# EAGLE design A3941_MD_T (EAGLE 5.11)
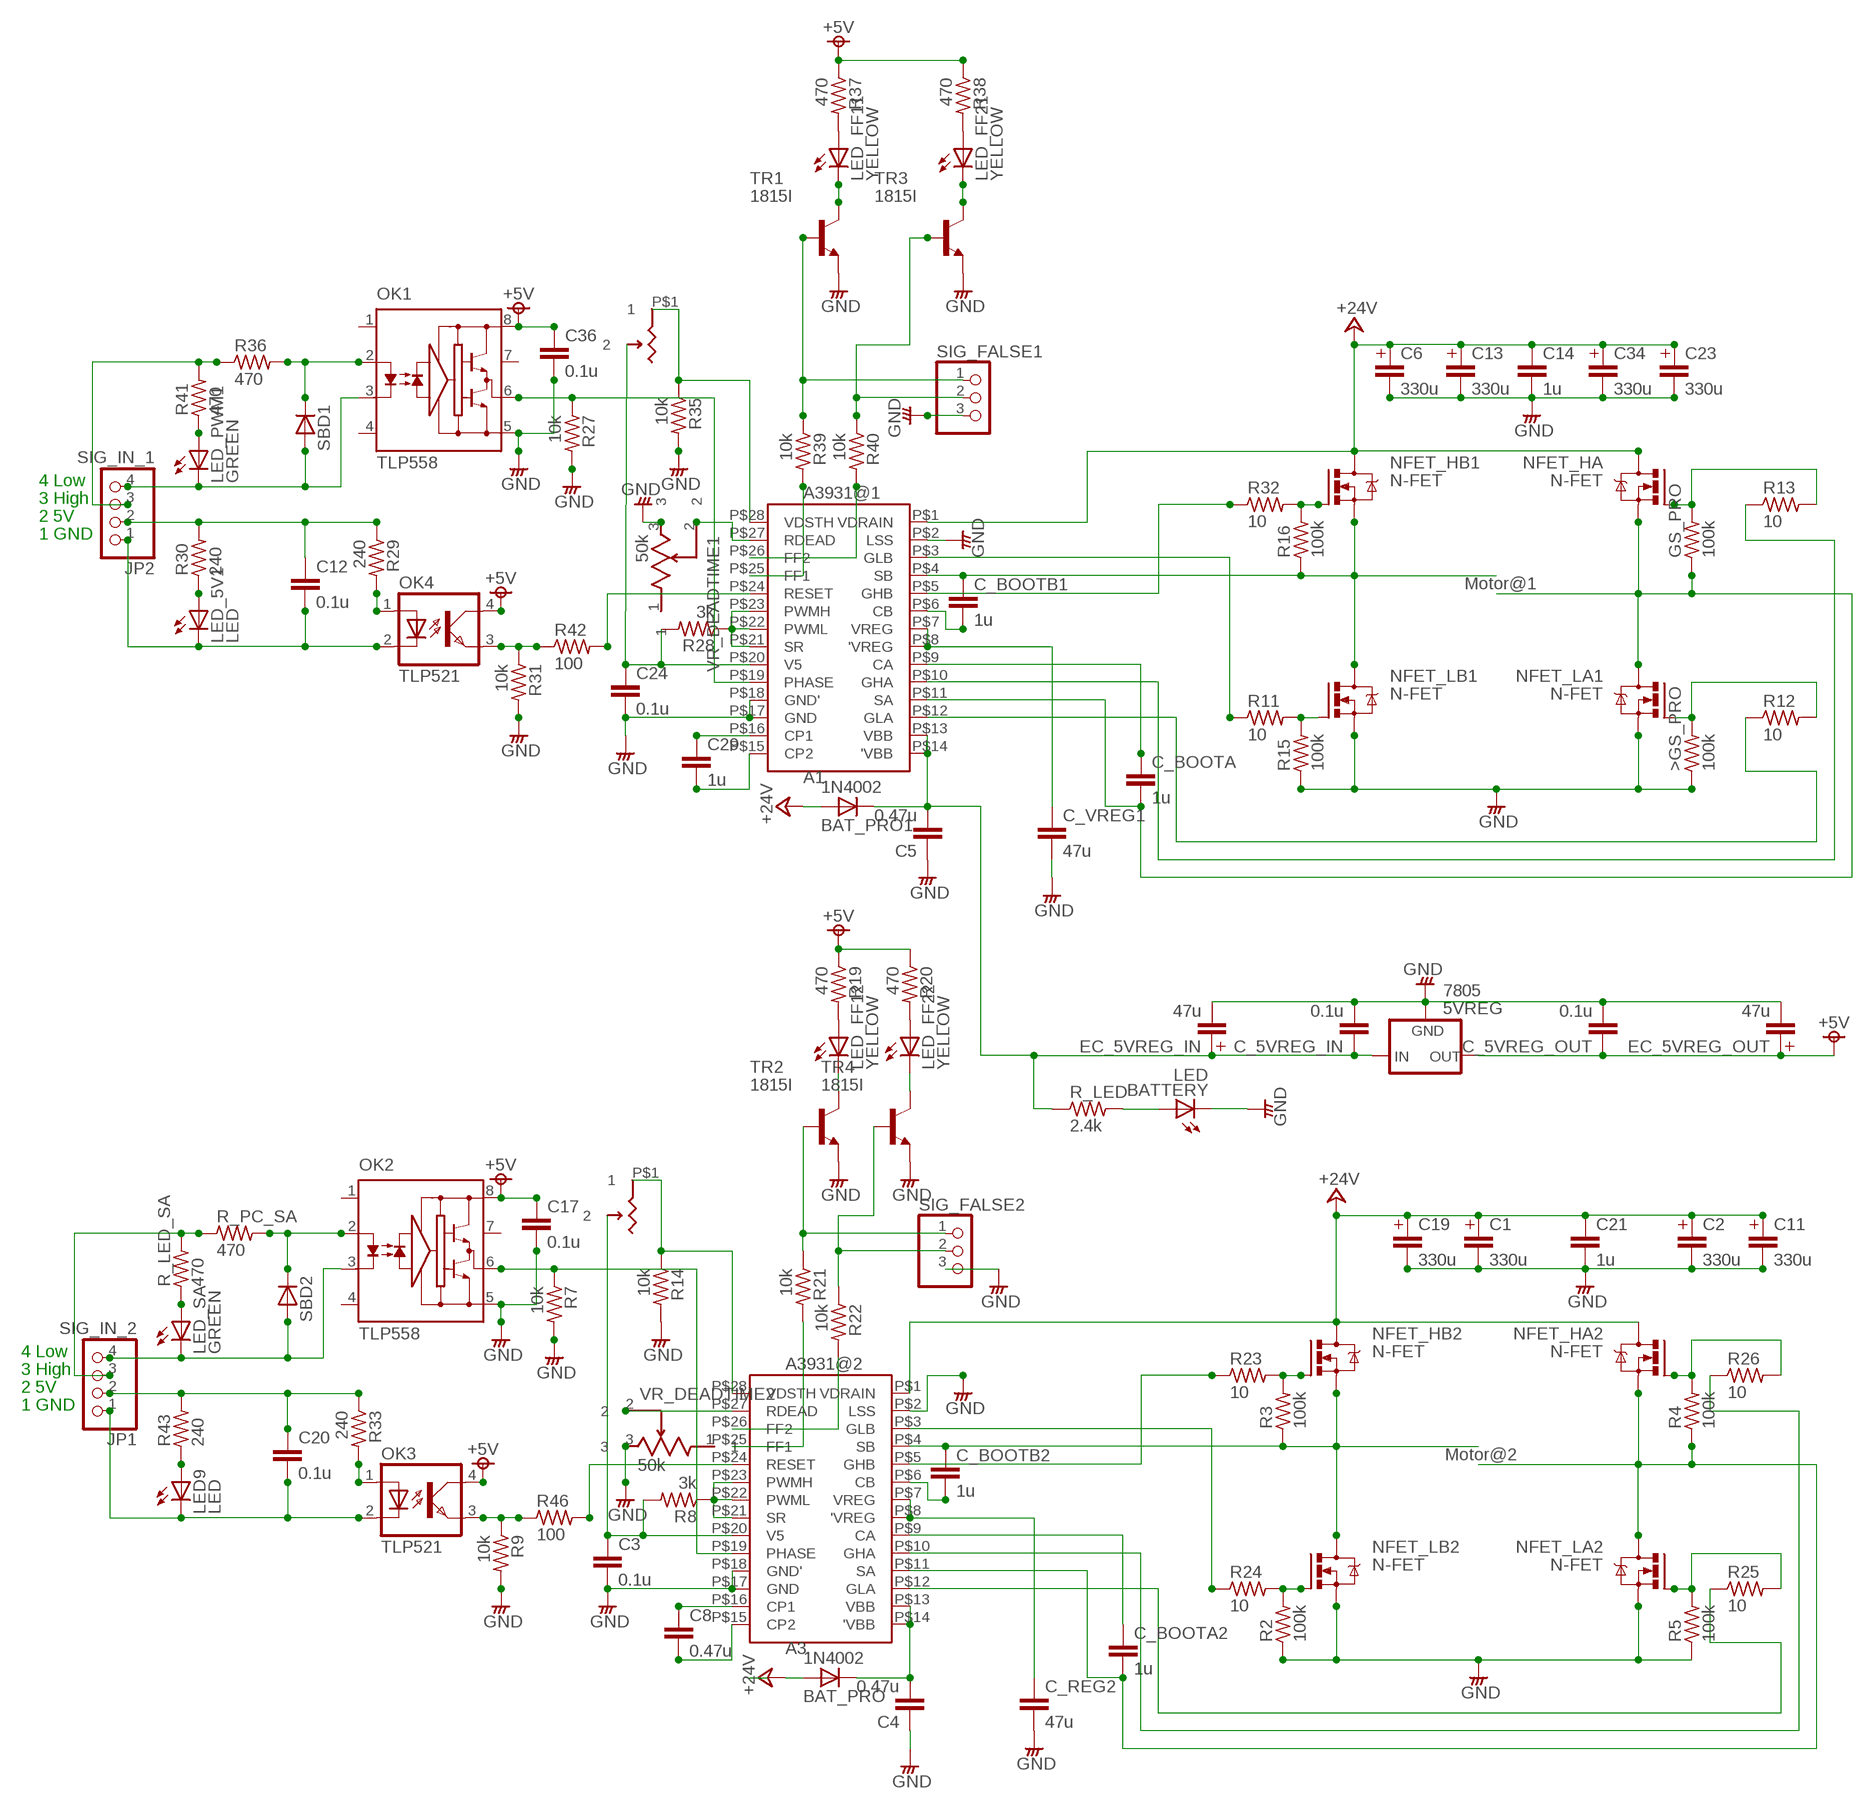
[diagram p0: schematic, sheet 1]

## Parts
5VREG  7805  78  [78XX]
>GS_PRO  100k  RESISTORS-3  [R_0.3]
A1  A3931@1  A3941  [IC_SOCKET_28_600MIL]
A3  A3931@2  A3941  [IC_SOCKET_28_600MIL]
BAT_PRO  1N4002  DIODE-2  [DIODE_2]
BAT_PRO1  1N4002  DIODE-2  [DIODE_2]
BATTERY  LED  LED3MM  [LED3MM]
C1  330u  CAPACITOR-3  [C_0.3]
C2  330u  CAPACITOR-3  [C_0.3]
C3  0.1u  MLCC-2  [MLCC_50]
C4  0.47u  MLCC-1  [MLCC_25]
C5  0.47u  MLCC-1  [MLCC_25]
C6  330u  CAPACITOR-3  [C_0.3]
C8  0.47u  MLCC-1  [MLCC_25]
C11  330u  CAPACITOR-3  [C_0.3]
C12  0.1u  MLCC-1  [MLCC_25]
C13  330u  CAPACITOR-3  [C_0.3]
C14  1u  MLCC-2  [MLCC_50]
C17  0.1u  MLCC-2  [MLCC_50]
C19  330u  CAPACITOR-3  [C_0.3]
C20  0.1u  MLCC-1  [MLCC_25]
C21  1u  MLCC-2  [MLCC_50]
C23  330u  CAPACITOR-3  [C_0.3]
C24  0.1u  MLCC-2  [MLCC_50]
C29  1u  MLCC-1  [MLCC_25]
C34  330u  CAPACITOR-3  [C_0.3]
C36  0.1u  MLCC-2  [MLCC_50]
C_5VREG_IN  0.1u  MLCC-1  [MLCC_25]
C_5VREG_OUT  0.1u  MLCC-1  [MLCC_25]
C_BOOTA  1u  MLCC-2  [MLCC_50]
C_BOOTA2  1u  MLCC-2  [MLCC_50]
C_BOOTB1  1u  MLCC-2  [MLCC_50]
C_BOOTB2  1u  MLCC-2  [MLCC_50]
C_REG2  47u  MLCC-1  [MLCC_25]
C_VREG1  47u  MLCC-1  [MLCC_25]
EC_5VREG_IN  47u  CAPACITOR-2  [C_0.2]
EC_5VREG_OUT  47u  CAPACITOR-2  [C_0.2]
GS_PRO  100k  RESISTORS-3  [R_0.3]
JP1  SIG_IN_2  PINHD-1X41  [1*04]
JP2  SIG_IN_1  PINHD-1X41  [1*04]
LED9  LED  LED3MM  [LED3MM]
LED_5V1  LED  LED3MM  [LED3MM]
LED_FF11  YELLOW  LED3MM  [LED3MM]
LED_FF12  YELLOW  LED3MM  [LED3MM]
LED_FF21  YELLOW  LED3MM  [LED3MM]
LED_FF22  YELLOW  LED3MM  [LED3MM]
LED_PWM1  GREEN  LED3MM  [LED3MM]
LED_SA  GREEN  LED3MM  [LED3MM]
NFET_HA  N-FET  [TO-220V]
NFET_HA2  N-FET  [TO-220V]
NFET_HB1  N-FET  [TO-220V]
NFET_HB2  N-FET  [TO-220V]
NFET_LA1  N-FET  [TO-220V]
NFET_LA2  N-FET  [TO-220V]
NFET_LB1  N-FET  [TO-220V]
NFET_LB2  N-FET  [TO-220V]
OK1  TLP558  TLP251  [DIP8]
OK2  TLP558  TLP251  [DIP8]
OK3  TLP521  TLP621  [DIP4]
OK4  TLP521  TLP621  [DIP4]
R2  100k  RESISTORS-3  [R_0.3]
R3  100k  RESISTORS-3  [R_0.3]
R4  100k  RESISTORS-3  [R_0.3]
R5  100k  RESISTORS-3  [R_0.3]
R7  10k  RESISTORS-2  [R_0.2]
R8  3k  RESISTORS-1  [R_0.1]
R9  10k  RESISTORS-2  [R_0.2]
R11  10  RESISTORS  [R_0.4]
R12  10  RESISTORS  [R_0.4]
R13  10  RESISTORS  [R_0.4]
R14  10k  RESISTORS-2  [R_0.2]
R15  100k  RESISTORS-3  [R_0.3]
R16  100k  RESISTORS-3  [R_0.3]
R19  470  RESISTORS-2  [R_0.2]
R20  470  RESISTORS-2  [R_0.2]
R21  10k  RESISTORS-2  [R_0.2]
R22  10k  RESISTORS-2  [R_0.2]
R23  10  RESISTORS  [R_0.4]
R24  10  RESISTORS  [R_0.4]
R25  10  RESISTORS  [R_0.4]
R26  10  RESISTORS  [R_0.4]
R27  10k  RESISTORS-2  [R_0.2]
R28  3k  RESISTORS-1  [R_0.1]
R29  240  RESISTORS-2  [R_0.2]
R30  240  RESISTORS-2  [R_0.2]
R31  10k  RESISTORS-2  [R_0.2]
R32  10  RESISTORS  [R_0.4]
R33  240  RESISTORS-2  [R_0.2]
R35  10k  RESISTORS-2  [R_0.2]
R36  470  RESISTORS-2  [R_0.2]
R37  470  RESISTORS-2  [R_0.2]
R38  470  RESISTORS-2  [R_0.2]
R39  10k  RESISTORS-2  [R_0.2]
R40  10k  RESISTORS-2  [R_0.2]
R41  470  RESISTORS-2  [R_0.2]
R42  100  RESISTORS-2  [R_0.2]
R43  240  RESISTORS-2  [R_0.2]
R46  100  RESISTORS-2  [R_0.2]
R_LED  2.4k  RESISTORS-2  [R_0.2]
R_LED_SA  470  RESISTORS-2  [R_0.2]
R_PC_SA  470  RESISTORS-2  [R_0.2]
SBD1  DIODE-2  [DIODE_2]
SBD2  DIODE-2  [DIODE_2]
SIG_FALSE1  PINHD-1X3-1  [1*03]
SIG_FALSE2  PINHD-1X3-1  [1*03]
TR1  1815I  [TO92A]
TR2  1815I  [TO92A]
TR3  1815I  [TO92A]
TR4  1815I  [TO92A]
VR1  50k  R_TRIM_2  [3362P_BOURNS_2PIN]
VR2  50k  R_TRIM_2  [3362P_BOURNS_2PIN]
VR_DEADTIME1  50k  SEMI_FIXED_RESISTOR_MULTI_TURN  [SEMI_FIXED_RESISTOR_MULTI_TURN]
VR_DEADTIME2  50k  SEMI_FIXED_RESISTOR_MULTI_TURN  [SEMI_FIXED_RESISTOR_MULTI_TURN]

## Nets
+5V: 5VREG.P$3(OUT) C17.1 C36.1 C_5VREG_OUT.1 EC_5VREG_OUT.P$1 OK1.8 OK2.8 OK3.4(COL) OK4.4(COL) R19.1 R20.1 R37.1 R38.1
+24V: A1.P$1(VDRAIN) A3.P$1(VDRAIN) BAT_PRO1.A BAT_PRO.A C1.P$1 C2.P$1 C6.P$1 C11.P$1 C13.P$1 C14.1 C19.P$1 C21.1 C23.P$1 C34.P$1 NFET_HA2.2(D) NFET_HA.2(D) NFET_HB1.2(D) NFET_HB2.2(D)
FF1: R21.1 SIG_FALSE2.1 TR2.B
FF2: R39.1 SIG_FALSE1.1 TR1.B
GND: 5VREG.P$2(GND) >GS_PRO.1 A1.P$2(LSS) A1.P$17(GND) A1.P$18(GND') A3.P$2(LSS) A3.P$17(GND) A3.P$18(GND') BATTERY.K(C) C1.P$2 C2.P$2 C3.2 C4.1 C5.1 C6.P$2 C11.P$2 C13.P$2 C14.2 C17.2 C19.P$2 C21.2 C23.P$2 C24.2 C34.P$2 C36.2 C_5VREG_IN.2 C_5VREG_OUT.2 C_REG2.2 C_VREG1.2 EC_5VREG_IN.P$2 EC_5VREG_OUT.P$2 NFET_LA1.3(S) NFET_LA2.3(S) NFET_LB1.3(S) NFET_LB2.3(S) OK1.5 OK2.5 R2.1 R5.1 R7.2 R9.2 R14.2 R15.1 R27.2 R31.2 R35.2 SIG_FALSE1.3 SIG_FALSE2.3 TR1.E TR2.E TR3.E TR4.E VR_DEADTIME1.3 VR_DEADTIME2.3
N$2: NFET_LB2.1(G) R2.2 R24.2
N$3: NFET_LA2.1(G) R5.2 R25.2
N$4: A3.P$11(SA) C_BOOTA2.2 NFET_HA2.3(S) NFET_LA2.2(D) R4.1
N$5: A1.P$4(SB) C_BOOTB1.1 NFET_HB1.3(S) NFET_LB1.2(D) R16.1
N$6: A3.P$10(GHA) R26.1
N$7: A3.P$3(GLB) R24.1
N$8: A3.P$12(GLA) R25.1
N$9: A3.P$19(PHASE) OK2.6 R7.1
N$10: A3.P$5(GHB) R23.1
N$11: A3.P$6(CB) C_BOOTB2.2
N$12: A3.P$9(CA) C_BOOTA2.1
N$13: A3.P$7(VREG) A3.P$8('VREG) C_REG2.1
N$14: A3.P$20(V5) C3.1 R8.2 VR2.P$2
N$15: BATTERY.A R_LED.2
N$16: OK3.3(EMIT) R9.1 R46.1
N$17: LED_5V1.A R30.1
N$18: A3.P$21(SR) A3.P$22(PWML) A3.P$23(PWMH) R8.1
N$19: NFET_LB1.1(G) R11.2 R15.2
N$20: NFET_HB1.1(G) R16.2 R32.2
N$21: >GS_PRO.2 NFET_LA1.1(G) R12.2
N$22: GS_PRO.2 NFET_HA.1(G) R13.2
N$23: A1.P$11(SA) C_BOOTA.2 GS_PRO.1 NFET_HA.3(S) NFET_LA1.2(D)
N$24: A3.P$4(SB) C_BOOTB2.1 NFET_HB2.3(S) NFET_LB2.2(D) R3.1
N$25: A1.P$10(GHA) R13.1
N$26: A1.P$3(GLB) R11.1
N$27: A1.P$12(GLA) R12.1
N$28: C12.1 JP2.2 R29.1 R30.2
N$29: A3.P$28(VDSTH) R14.1 VR2.P$1
N$30: R22.1 SIG_FALSE2.2 TR4.B
N$31: LED_FF12.A R19.2
N$32: LED_FF12.K(C) TR2.C
N$33: LED_FF22.A R20.2
N$34: LED_FF22.K(C) TR4.C
N$35: OK4.1(A) R29.2
N$36: A3.P$25(FF1) R21.2
N$37: A3.P$26(FF2) R22.2
N$38: LED9.A R43.1
N$39: C12.2 JP2.1 LED_5V1.K(C) OK4.2(C)
N$40: A1.P$27(RDEAD) VR_DEADTIME1.2
N$41: A1.P$19(PHASE) OK1.6 R27.1
N$42: A1.P$16(CP1) C29.1
N$43: A1.P$5(GHB) R32.1
N$44: A1.P$6(CB) C_BOOTB1.2
N$45: A1.P$9(CA) C_BOOTA.1
N$46: A1.P$7(VREG) A1.P$8('VREG) C_VREG1.1
N$47: LED_PWM1.A R41.1
N$48: C20.1 JP1.2 R33.1 R43.2
N$49: OK3.1(A) R33.2
N$50: A1.P$15(CP2) C29.2
N$51: A1.P$20(V5) C24.1 R28.2 VR1.P$2
N$52: OK4.3(EMIT) R31.1 R42.1
N$53: A1.P$21(SR) A1.P$22(PWML) A1.P$23(PWMH) R28.1
N$54: JP2.4 LED_PWM1.K(C) OK1.3 SBD1.A
N$55: OK1.2 R36.2 SBD1.C
N$56: JP2.3 R36.1 R41.2
N$58: A1.P$24(RESET) R42.2
N$59: A1.P$28(VDSTH) R35.1 VR1.P$1
N$60: R40.1 SIG_FALSE1.2 TR3.B
N$61: LED_FF11.A R37.2
N$62: LED_FF11.K(C) TR1.C
N$63: LED_FF21.A R38.2
N$64: LED_FF21.K(C) TR3.C
N$65: A1.P$25(FF1) R39.2
N$66: A1.P$26(FF2) R40.2
N$67: C20.2 JP1.1 LED9.K(C) OK3.2(C)
N$68: LED_SA.A R_LED_SA.1
N$69: JP1.4 LED_SA.K(C) OK2.3 SBD2.A
N$70: OK2.2 R_PC_SA.2 SBD2.C
N$72: JP1.3 R_LED_SA.2 R_PC_SA.1
N$73: A3.P$24(RESET) R46.2
N$74: A3.P$27(RDEAD) VR_DEADTIME2.2
N$75: A3.P$16(CP1) C8.1
N$76: A3.P$15(CP2) C8.2
N$77: NFET_HB2.1(G) R3.2 R23.2
N$78: NFET_HA2.1(G) R4.2 R26.2
N$87: A3.P$13(VBB) A3.P$14('VBB) BAT_PRO.C C4.2
N$94: 5VREG.P$1(IN) A1.P$13(VBB) A1.P$14('VBB) BAT_PRO1.C C5.2 C_5VREG_IN.1 EC_5VREG_IN.P$1 R_LED.1
Unconnected: OK1.1 OK1.4 OK1.7 OK2.1 OK2.4 OK2.7 VR_DEADTIME1.1 VR_DEADTIME2.1

## Notes on the sheet
- 4 Low
- 3 High
- 2 5V
- 1 GND
- Motor@1
- 4 Low
- 3 High
- 2 5V
- 1 GND
- Motor@2

## Library data of the parts
5VREG = regulator_s:78*: VOLTAGE REGULATOR
>GS_PRO GS_PRO R2-R5 R7-R9 R11-R16 R19-R33 R35-R43 R46 R_LED R_LED_SA R_PC_SA = rcl__s:RESISTORS
A1 A3 = DIP_CONVERTOR:A3941: KEL IC socket 28P / Akiduki / P-01563
BAT_PRO BAT_PRO1 SBD1 SBD2 = diode_s:DIODE
BATTERY LED9 LED_5V1 LED_FF11 LED_FF12 LED_FF21 LED_FF22 LED_PWM1 LED_SA = LED_s:LED: LED OSRAM: - CHIPLED LG R971, LG N971, LY N971, LG Q971, LY Q971, LO R971, LY R971 LH N974, LH R974 LS Q976, LO Q976, LY Q976 LO Q996 - Hyper CHIPLED LW Q18S LB Q993, LB Q99A, LB R99A - SideLED LS A670, LO A670, LY A670, LG A670, LP A670 LB A673, LV A673, LT A673, LW A673 LH A674 LY A675 LS A676, LA A676, LO A676, LY A676, LW A676 LS A679, LY A679, LG A679 - Hyper Micro SIDELED® LS Y876, LA Y876, LO Y876, LY Y876 LT Y87S - SmartLED LW L88C, LW L88S LB L89C, LB L89S, LG L890 LS L89K, LO L89K, LY L89K LS L896, LA L896, LO L896, LY L896 - TOPLED LS T670, LO T670, LY T670, LG T670, LP T670 LSG T670, LSP T670, LSY T670, LOP T670, LYG T670 LG T671, LOG T671, LSG T671 LB T673, LV T673, LT T673, LW T673 LH T674 LS T676, LA T676, LO T676, LY T676, LB T676, LH T676, LSB T676, LW T676 LB T67C, LV T67C, LT T67C, LS T67K, LO T67K, LY T67K, LW E67C LS E67B, LA E67B, LO E67B, LY E67B, LB E67C, LV E67C, LT E67C LW T67C LS T679, LY T679, LG T679 LS T770, LO T770, LY T770, LG T770, LP T770 LB T773, LV T773, LT T773, LW T773 LH T774 LS E675, LA E675, LY E675, LS T675 LS T776, LA T776, LO T776, LY T776, LB T776 LHGB T686 LT T68C, LB T68C - Hyper Mini TOPLED® LB M676 - Mini TOPLED Santana® LG M470 LS M47K, LO M47K, LY M47K Source: http://www.osram.convergy.de - LUMILED® LXK2-PW12-R00, LXK2-PW12-S00, LXK2-PW14-U00, LXK2-PW14-V00 LXK2-PM12-R00, LXK2-PM12-S00, LXK2-PM14-U00 LXK2-PE12-Q00, LXK2-PE12-R00, LXK2-PE12-S00, LXK2-PE14-T00, LXK2-PE14-U00 LXK2-PB12-K00, LXK2-PB12-L00, LXK2-PB12-M00, LXK2-PB14-N00, LXK2-PB14-P00, LXK2-PB14-Q00 LXK2-PR12-L00, LXK2-PR12-M00, LXK2-PR14-Q00, LXK2-PR14-R00 LXK2-PD12-Q00, LXK2-PD12-R00, LXK2-PD12-S00 LXK2-PH12-R00, LXK2-PH12-S00 LXK2-PL12-P00, LXK2-PL12-Q00, LXK2-PL12-R00 Source: www.luxeon.com
C1 C2 C6 C11 C13 C19 C23 C34 EC_5VREG_IN EC_5VREG_OUT = rcl__s:CAPACITOR
C3-C5 C8 C12 C14 C17 C20 C21 C24 C29 C36 C_5VREG_IN C_5VREG_OUT C_BOOTA C_BOOTA2 C_BOOTB1 C_BOOTB2 C_REG2 C_VREG1 = rcl__s:MLCC: CAPACITOR, European symbol
JP1 JP2 = pinhead_s:PINHD-1X4: PIN HEADER
NFET_HA NFET_HA2 NFET_HB1 NFET_HB2 NFET_LA1 NFET_LA2 NFET_LB1 NFET_LB2 = FET_s:N-FET
OK1 OK2 = photocoupler_s:TLP251
OK3 OK4 = photocoupler_s:TLP621: SHARP OPTO COUPLER
SIG_FALSE1 SIG_FALSE2 = pinhead_s:PINHD-1X3: PIN HEADER
TR1-TR4 = transistor_s:1815: NPN Transistor
VR1 VR2 = rlc_tutrobo:R_TRIM_2
VR_DEADTIME1 VR_DEADTIME2 = Semi_fixed_resistor_multi_turn:SEMI_FIXED_RESISTOR_MULTI_TURN

## Board
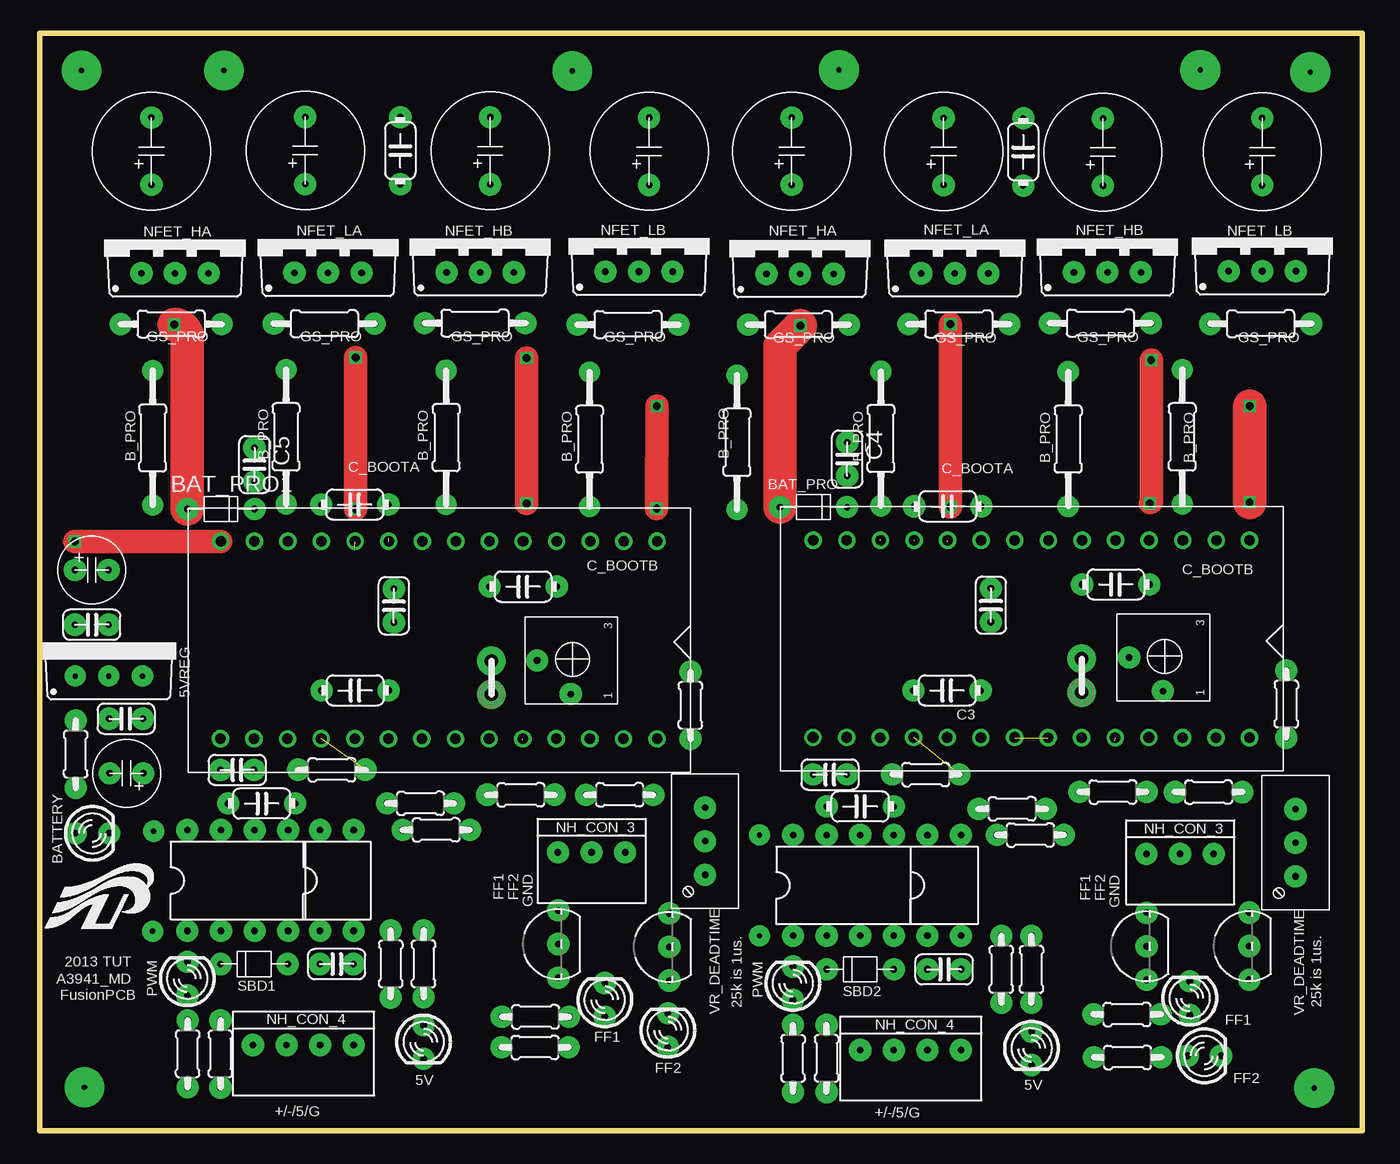
[diagram p1: board, top side]
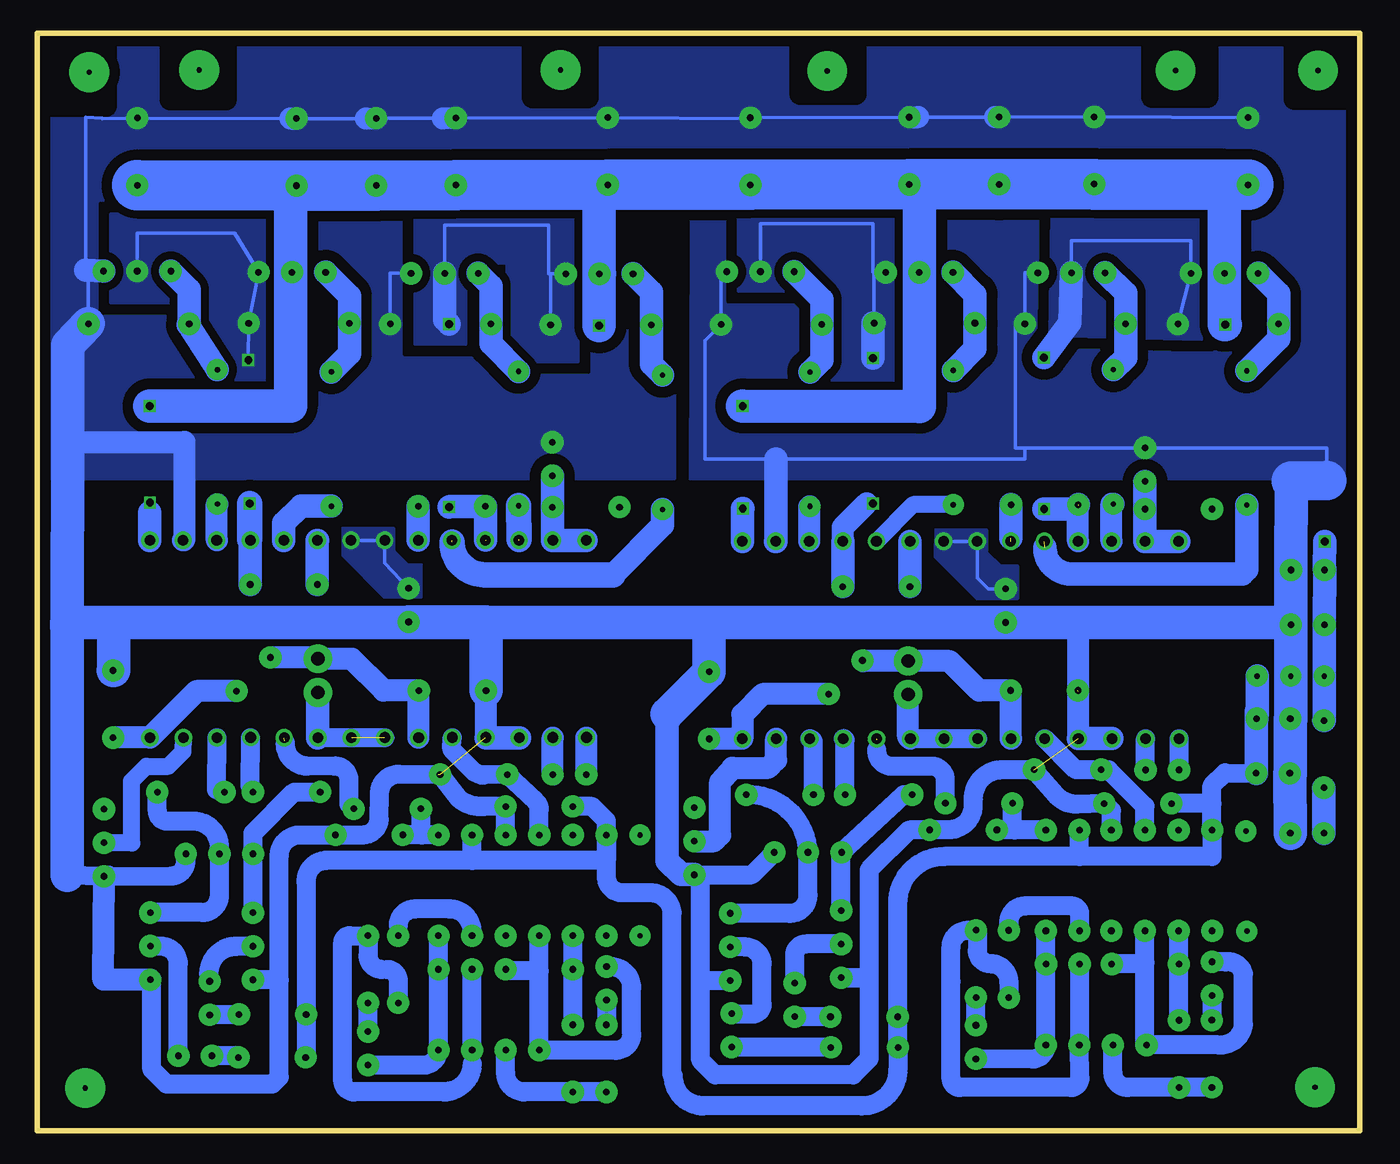
[diagram p2: board, bottom side, seen from below]

Size 100 x 83 mm. Coordinates in mm from the lower left corner, seen from the top.
Outline: 100,0 0,0 0,83 100,83 100,0
Copper layers (1*16): Top 0.035mm / dielectric 1.5mm / Bottom 0.035mm
Design rules "Fusion_eagle_rule_v1.1": minimum track width 6mil, minimum drill 12mil, track to track 6mil, track to pad 6mil, pad to pad 6mil, via to via 6mil, smd to smd 0mil, copper to edge 10mil, drill to drill 10mil, minimum pad ring 10mil, minimum via ring 6mil, stop-mask expansion 2mil, vias tented up to drill 100mil, thermal gap 10mil
bKeepout: area 92.6,-21.2 to 95.1,-18.7; 8 lines
tRestrict: area 38.1,78.4 to 42.3,82.5; area 45.7,87.3 to 50,91.4; area 58.4,78.1 to 62.6,82.3; area 85.7,78 to 89.9,82.2; area 94.9,77.5 to 99.1,81.7; area 11.8,78.2 to 16,82.3; area 0.9,78 to 5.2,82.2
bRestrict: area 38.1,87.3 to 42.3,91.4; area 38.1,78.4 to 42.3,82.5; area 58.3,78.1 to 62.6,82.3; area 85.7,78 to 89.9,82.2; area 94.8,77.5 to 99,81.7; area 11.5,78.2 to 15.7,82.3; area 0.7,78 to 5,82.2

### Footprints (pad centres in the part's own frame; a part is rotated, then mirrored left to right if it is on the bottom)
78XX = drill 0.399 pad 1.598 round: P$1 -2.54,0; P$2 0,0; P$3 2.54,0
R_0.3 = drill 0.5 pad 1.676 round: 1 -3.81,0; 2 3.81,0
IC_SOCKET_28_600MIL = drill 0.8 round: P$1 -16.51,-6.35; P$2 -13.995,-6.35; P$3 -11.455,-6.35; P$4 -8.915,-6.35; P$5 -6.375,-6.35; P$6 -3.835,-6.35; P$7 -1.295,-6.35; P$8 1.245,-6.35; P$9 3.785,-6.35; P$10 6.325,-6.35; P$11 8.865,-6.35; P$12 11.405,-6.35; P$13 13.945,-6.35; P$14 16.485,-6.35; P$15 16.51,8.56; P$16 13.97,8.56; P$17 11.43,8.585; P$18 8.89,8.56; P$19 6.35,8.56; P$20 3.81,8.585; P$21 1.27,8.56; P$22 -1.27,8.585; P$23 -3.81,8.585; P$24 -6.35,8.585; P$25 -8.89,8.56; P$26 -11.43,8.585; P$27 -13.97,8.585; P$28 -16.51,8.585
DIODE_2 = drill 0.5 pad 1.676 round: A -2.54,0; C 2.54,0
LED3MM = drill 0.5 pad 1.676 round: A -1.27,0; K 1.27,0
C_0.3 = drill 0.5 pad 1.676 round: P$1 -2.54,0; P$2 2.54,0
MLCC_50 = drill 0.5 pad 1.676 round: 1 -2.54,0; 2 2.54,0
MLCC_25 = drill 0.5 pad 1.676 round: 1 -1.27,0; 2 1.27,0
C_0.2 = drill 0.5 pad 1.676 round: P$1 -1.27,0; P$2 1.27,0
1*04 = drill 0.5 pad 1.676 round: 1 3.81,0; 2 1.27,0; 3 -1.27,0; 4 -3.81,0
TO-220V = drill 0.5 pad 1.676 round: 1 -2.54,0; 2 0,0; 3 2.54,0
DIP8 = drill 0.5 pad 1.676 round: 1 -3.81,-3.81; 2 -1.27,-3.81; 3 1.27,-3.81; 4 3.81,-3.81; 5 3.81,3.81; 6 1.27,3.81; 7 -1.27,3.81; 8 -3.81,3.81
DIP4 = drill 0.5 pad 1.676 round: 1 -1.27,-3.81; 2 1.27,-3.81; 3 1.27,3.81; 4 -1.27,3.81
R_0.2 = drill 0.5 pad 1.676 round: 1 -2.54,0; 2 2.54,0
R_0.1 = drill 1 pad 2.184 round: 1 -1.27,0; 2 1.27,0
R_0.4 = drill 0.399 pad 1.598 round: 1 -5.08,0; 2 5.08,0
1*03 = drill 0.5 pad 1.676 round: 1 -2.54,0; 2 0,0; 3 2.54,0
TO92A = drill 0.5 pad 1.676 round: B 2.54,0; C 0,0; E -2.54,0
3362P_BOURNS_2PIN = drill 0.5 pad 1.676 round: P$1 -2.54,-0.01; P$2 0,2.55
SEMI_FIXED_RESISTOR_MULTI_TURN = drill 0.5 pad 1.676 round: 1 -2.54,0; 2 0,0; 3 2.54,0

### Placement (x,y rotation side)
5VREG  5.23,34.37 0 top
>GS_PRO  21.52,61.02 180 top
A1  30.18,38.21 180 top
A3  74.99,38.29 180 top
BAT_PRO  58.52,47.15 0 top
BAT_PRO1  13.71,47.01 0 top
BATTERY  3.99,22.48 0 top
C1  56.87,74.07 90 top
C2  68.36,74.04 90 top
C3  68.61,33.28 180 top
C4  61.07,50.79 270 top
C5  16.25,50.36 270 top
C6  46.09,74.06 90 top
C8  59.77,26.93 180 top
C11  92.45,74.03 90 top
C12  22.46,12.59 0 top
C13  20.09,74.12 90 top
C14  27.27,74.1 90 top
C17  62.05,24.51 0 top
C19  80.4,74 90 top
C20  68.4,12.19 0 top
C21  74.38,74.01 90 top
C23  8.45,74.07 90 top
C24  23.86,33.28 180 top
C29  14.94,27.27 180 top
C34  34.07,74.1 90 top
C36  16.79,24.74 0 top
C_5VREG_IN  3.94,38.26 0 top
C_5VREG_OUT  6.53,31.15 180 top
C_BOOTA  23.83,47.34 180 top
C_BOOTA2  68.67,47.21 180 top
C_BOOTB1  36.56,41.14 180 top
C_BOOTB2  81.37,41.3 180 top
C_REG2  71.93,39.73 270 top
C_VREG1  26.78,39.69 270 top
EC_5VREG_IN  3.94,42.39 0 top
EC_5VREG_OUT  6.57,27.02 180 top
GS_PRO  9.95,61 180 top
JP1  65.86,6.1 0 top
JP2  19.94,6.47 0 top
LED9  75.01,6.22 270 top
LED_5V1  29.03,6.7 270 top
LED_FF11  42.74,9.89 90 top
LED_FF12  86.97,10.02 90 top
LED_FF21  47.51,7.59 90 top
LED_FF22  88.07,5.66 0 top
LED_PWM1  11.17,11.49 90 top
LED_SA  56.96,11.14 90 top
NFET_HA  10.23,64.83 0 top
NFET_HA2  57.5,64.79 0 top
NFET_HB1  33.31,64.9 0 top
NFET_HB2  80.74,64.92 0 top
NFET_LA1  21.81,64.87 0 top
NFET_LA2  69.2,64.83 0 top
NFET_LB1  45.32,64.96 0 top
NFET_LB2  92.45,64.99 0 top
OK1  14.98,18.91 0 top
OK2  60.78,18.54 0 top
OK3  68.4,18.54 0 top
OK4  22.47,18.91 0 top
R2  92.33,61.01 180 top
R3  80.22,61.06 180 top
R4  57.39,60.94 180 top
R5  69.51,60.99 180 top
R7  67.01,26.93 0 top
R8  78.79,34.41 90 top
R9  74.92,22.36 0 top
R11  41.59,52.29 90 top
R12  18.63,52.46 90 top
R13  8.55,52.38 90 top
R14  94.28,32.25 90 top
R15  44.49,60.96 180 top
R16  32.92,61.06 180 top
R19  82.22,8.78 0 top
R20  82.26,5.53 0 top
R21  81.16,25.61 0 top
R22  88.39,25.6 180 top
R23  77.78,52.3 90 top
R24  86.4,52.46 90 top
R25  63.62,52.34 90 top
R26  52.73,52.05 90 top
R27  22.1,27.29 0 top
R28  34.16,34.24 90 top
R29  26.55,12.61 90 top
R30  29.02,12.61 90 top
R31  29.98,22.74 0 top
R32  30.74,52.41 90 top
R33  72.72,12.19 90 top
R35  49.21,32.16 90 top
R36  13.67,5.8 90 top
R37  37.5,8.61 0 top
R38  37.46,6.29 0 top
R39  36.39,25.4 0 top
R40  43.86,25.4 180 top
R41  11.19,5.81 270 top
R42  28.8,24.75 0 top
R43  75.01,12.19 90 top
R46  73.54,24.34 0 top
R_LED  2.72,28.47 270 top
R_LED_SA  56.97,5.46 270 top
R_PC_SA  59.51,5.46 90 top
SBD1  16.22,12.59 180 top
SBD2  62.05,12.19 180 top
SIG_FALSE1  41.73,21.04 0 top
SIG_FALSE2  86.24,20.93 0 top
TR1  39.22,14.1 90 top
TR2  83.7,13.94 90 top
TR3  47.61,13.89 90 top
TR4  91.46,13.95 90 top
U$4  [TUTLOGO]  0.39,14.82 0 top
U$12  [WORLD_MAP_1000X600]  -22.86,12.7 0 top  (outside the outline)
VR1  40.16,35.55 90 top
VR2  84.93,35.78 90 top
VR_DEADTIME1  50.32,21.88 270 top
VR_DEADTIME2  94.96,21.76 270 top

### Tracks (layer width: path | path; a pad name or v marks a point on that pad's centre or on a via)
+5V
  Bottom 1.016: 34.96,6.29 R38.1 34.94,6.29 | OK1.8 11.18,22.72
  Bottom 1.422: 34.96,6.29 R37.1 34.96,17.2 arc90 31.43,20.73 21.2,20.73 | 21.2,20.73 OK4.4 | OK2.8 56.97,19.19 arc-90 55.77,17.99 53.87,17.99 arc90 52,16.5 52,4.15 51.92,4.15 arc-90 49.63,1.87 37.68,1.87 arc-90 34.94,4.57 34.94,6.29 | 11.18,22.72 11.18,20.73 21.2,20.73 | 67.13,20.43 OK3.4 | OK2.8 56.97,20.43 67.13,20.43 | 67.13,20.43 78.2,20.43 arc-90 79.69,18.79 R19.1 79.68,5.71 R20.1 79.69,5.56 | 11.18,24.73 11.18,26.09 10.21,27.07 EC_5VREG_OUT.P$1 | 11.18,24.73 11.18,22.98 OK1.8 | C36.1 11.19,24.74 11.18,24.73 | OK2.8 56.97,23.43 58.05,24.51 C17.1 | 7.81,31.71 C_5VREG_OUT.1
  Bottom 1.778: C_5VREG_OUT.1 7.77,31.6 5VREG.P$3 | EC_5VREG_OUT.P$1 7.81,31.71
+24V  (via drill 0.6)
  Top 1.778: v46.67,54.8 v46.66,47.03
  Top 2.54: v91.51,54.78 v91.49,47.5 | v10.16,60.96 arc-90 11.17,59.95 BAT_PRO1.A | BAT_PRO.A 55.98,59.31 v57.53,60.87
  Bottom 0.254: v91.49,47.5 91.51,46.76 91.5,46.74 | C34.P$1 33.31,71.57 | NFET_HA2.2 57.5,64.67 57.53,64.67 | C1.P$1 57.53,71.46 | 80.85,64.92 NFET_HB2.2
  Bottom 1.676: C11.P$1 92.32,71.46
  Bottom 1.778: 91.5,46.74 A3.P$1 | A1.P$1 46.7,47 arc90 v46.66,47.03
  Bottom 2.54: 33.31,71.57 NFET_HB1.2 33.31,54.76 v46.67,54.8 | v10.16,60.96 10.23,60.96 NFET_HA.2 10.23,71.53 10.16,71.53 | 57.53,71.46 57.53,64.67 | v57.53,60.87 57.53,64.77 NFET_HA2.2 | 81.66,71.47 80.85,70.66 80.85,64.92 80.85,54.8 91.49,54.8 v91.51,54.78
  Bottom 3.81: C11.P$1 81.66,71.47 C19.P$1 C21.1 C2.P$1 C1.P$1 C6.P$1 C34.P$1 C14.1 C13.P$1 20.07,71.53 10.16,71.53 C23.P$1
D2  (via drill 0.4 pad 3)
  other vias: 87.77,80.2
FF1
  Bottom 1.016: SIG_FALSE2.1
  Bottom 1.422: TR2.B SIG_FALSE2.1 | R21.1 80.57,25.61 83.7,22.48 SIG_FALSE2.1
FF2
  Bottom 1.016: 39.22,21.04 SIG_FALSE1.1
  Bottom 1.422: TR1.B 39.22,21.04 | R39.1 34.51,25.39 SIG_FALSE1.1
GND  (4 unrouted)
  Bottom 0.254: 27.6,76.65 C34.P$2 | 33.4,76.65 C6.P$2 46.09,76.53 C1.P$2 | C2.P$2 57.64,76.55 | C21.2 69.35,76.55 | C19.P$2 75.15,76.54 | 80.85,76.54 C11.P$2 95.09,76.54 95.09,76.55 96.36,76.64 96.36,65.09 | NFET_LB2.3 96.16,64.99 R2.1 | C23.P$2 C13.P$2 C14.2 | NFET_LA1.3 25.33,64.87 >GS_PRO.1 26.05,61.02 26.03,51.63 25.33,51.63 | 25.33,51.63 25.33,50.8 44.16,50.8 48.28,50.79 48.31,50.77 49.54,50.77 49.53,59.73 R15.1 48.3,64.95 NFET_LB1.3 | 25.33,51.63 C5.1 2.5,51.63 2.5,49.17 | NFET_LA2.3 73.32,64.83 R5.1
  Bottom 1.016: VR_DEADTIME2.3 94.57,19.53
  Bottom 1.422: 69.7,26.92 72.69,26.96 arc-90 74.13,25.44 74.15,23.53 arc84 75.39,22.36 R9.2 80.12,22.36 arc-91 81.72,20.8 81.72,11.39 | OK2.5 C17.2 66.25,24.51 arc45 68.12,25.1 R7.2 | 81.72,11.39 TR2.E | SIG_FALSE2.3 88.78,20.39 arc90 89.91,19.25 VR_DEADTIME2.3 94.96,19.24 97.74,19.31 | A1.P$17 18.75,29.65 | TR4.E 91.34,11.41 91.34,4.63 90.23,3.51 82.24,3.51 81.72,4.03 81.72,11.39 | 81.72,11.39 | 66.07,29.71 arc90 A3.P$18 | OK1.5 18.79,24.2 C36.2 21.4,24.67 arc47 22.96,25.35 R27.2 27.09,27.29 arc-90 29.25,25.04 29.24,24.53 arc90 31.09,22.76 R31.2 32.53,22.73 34.07,22.73 37.11,19.7 37.11,11.56 TR1.E 37.1,11.56 37.1,5.44 38.33,4.22 48.75,4.22 49.85,5.32 49.85,11.43 | 49.85,11.43 49.85,18.87 VR_DEADTIME1.3 | TR3.E 49.77,11.35 49.85,11.43 | VR_DEADTIME1.3 45.97,19.34 SIG_FALSE1.3 | VR_DEADTIME1.3 arc90 50.33,19.33
  Bottom 1.676: C14.2 27.6,76.65 | C34.P$2 33.4,76.65 | 69.35,76.55 C2.P$2 | 75.15,76.54 C21.2 | 80.85,76.54 C19.P$2 | A1.P$17 | TR4.E 95.01,11.41 VR_DEADTIME2.3 | A1.P$18 21.29,33.23 | C3.2 66.07,29.75 A3.P$18 | C24.2 21.32,38.15 21.59,38.42 | VR_DEADTIME1.3 50.35,19.37 | A3.P$2 arc-90 88.9,44.72 88.9,52.07 97.72,52.07
  Bottom 1.778: 18.75,29.65 A1.P$18 | A3.P$17 66.07,29.71 | NFET_LB2.3 96.36,65.09 | BATTERY.K | EC_5VREG_OUT.P$2 5.26,26.92 | C_5VREG_OUT.2 5.23,31.06 | 5VREG.P$2 5.21,34.37 | A1.P$2 arc-90 44.16,44.58 44.16,50.8 | 50.35,19.37 51.34,19.37 52.38,20.41 52.38,31.52
  Bottom 2.54: BATTERY.K EC_5VREG_OUT.P$2 | 5.26,26.92 C_5VREG_OUT.2 | 5.23,31.06 5VREG.P$2 | 97.74,19.31 97.73,38.55 97.72,52.07 97.72,59.39 R2.1 | 5.18,49.1 EC_5VREG_IN.P$2 arc-90 EC_5VREG_IN.P$2 C_5VREG_IN.2 | 5.21,34.37 C_5VREG_IN.2 | C_5VREG_IN.2 5.21,38.42 21.59,38.42 C_VREG1.2 94.25,38.42 | 45.49,38.42 arc-90 45.49,38.43 49.21,38.43 R35.2 52.38,31.52 | 94.25,38.42 97.79,38.42 97.79,38.1 | R14.2 94.25,34.79 94.25,38.42 | C3.2 66.07,38.47 C_REG2.2
  Bottom 3: 5.18,49.1 2.5,49.17
  pour Bottom (isolate 0.813, rank 4, no thermals): -5.08,86.36 50.48,86.36 50.61,49.29 -4.96,49.3
  pour Bottom (isolate 0.813, rank 4, no thermals): 106.68,86.36 106.8,49.31 51.83,49.31 51.79,74.37 49.51,74.37 49.53,86.36
N$1  (via drill 0.4 pad 1.6)
  other vias: 54.43,14.73
N$2
  Bottom 1.778: NFET_LB2.1 88.52,63.6 R2.2 88.59,60.95 R24.2
N$3
  Bottom 1.778: R25.2 65.7,59.5 R5.2 65.7,63.87 NFET_LA2.1
N$4  (via drill 0.6)  (1 unrouted)
  Top 1.778: v68.86,47.14 v68.87,60.99
  Bottom 0.254: R4.1 61.2,64.79 NFET_HA2.3 61.34,64.79 61.34,68.48 69.2,68.48 NFET_LA2.2
  Bottom 1.778: v68.87,60.99 69.2,61.32 NFET_LA2.2 | A3.P$11 C_BOOTA2.2 68.8,47.21 v68.86,47.14
  pour Bottom (isolate 0.61, no thermals): 59.14,69.36 71.45,69.36 71.45,59.49 67.63,59.49 67.63,65.6 64.48,65.6 64.48,58.17 59.14,58.17
N$5  (via drill 0.6)
  Top 1.778: v36.83,47.42 v36.83,58.42
  Bottom 0.254: R16.1 36.73,64.91 NFET_HB1.3 36.83,64.91 36.83,68.58 45.32,68.58 NFET_LB1.2 | 37.3,47.42 v36.83,47.42
  Bottom 1.676: 37.3,47.42 39.09,45.63 A1.P$4
  Bottom 1.778: v36.83,58.42 36.83,61.06 R16.1 | A1.P$4 C_BOOTB1.1
  pour Bottom (isolate 0.61, no thermals): 34.29,69.85 46.99,69.85 46.99,63.5 40.64,63.5 40.64,55.88 34.29,55.88
N$6  (1 unrouted)
  Bottom 1.778: R26.1 52.73,45.78 56.48,42.03
  Bottom 1.93: 56.48,42.03 66.19,42.03 arc90 68.66,44.5
N$7
  Bottom 1.676: R24.1 arc-90 86.44,47.34 A3.P$3
N$8  (1 unrouted)
  Bottom 1.93: 63.58,44.7 R25.1
N$9
  Bottom 1.422: OK2.6 62.05,24.29 arc-47 62.31,24.88 R7.1 66.24,26.88 arc42 67.02,27.18 68.67,28.83 A3.P$19
N$10
  Bottom 1.778: R23.1 80.08,47.22 81.36,45.93 A3.P$5 | A3.P$5
N$11
  Bottom 1.778: A3.P$6 C_BOOTB2.2
N$12
  Bottom 1.676: A3.P$9
  Bottom 1.778: A3.P$9 71.21,44.66 C_BOOTA2.1
N$13
  Bottom 0.254: C_REG2.1 73.74,42.92 A3.P$8 A3.P$7
  pour Bottom (no thermals): 73.05,45.32 73.05,43.82 72,42.77 70.98,42.79 70.98,40.35 73.75,40.33 76.9,43.48 76.9,45.55 73.06,45.55
N$14
  Bottom 1.676: VR2.P$2 78.89,35.78 R8.2 76.23,35.68 73.83,33.28 C3.1 71.18,33.26 A3.P$20
N$15
  Bottom 1.778: R_LED.2 BATTERY.A
N$16
  Bottom 1.016: 70.94,22.36 71,22.42
  Bottom 1.422: OK3.3 69.75,22.36 70.94,22.36 R9.1 | 71,22.42 R46.1
N$17
  Bottom 1.422: LED_5V1.A R30.1
N$18  (1 unrouted)
  Bottom 1.422: A3.P$23 73.74,29.71 arc-90 A3.P$21
  Bottom 1.778: R8.1 arc-90 R8.1 A3.P$23
N$19
  Bottom 1.778: NFET_LB1.1 40.68,62.85 R15.2 40.68,58.27 R11.2
N$20
  Bottom 1.778: NFET_HB1.1 29.11,63.24 R16.2 29.11,59.13 R32.2
N$21
  Bottom 1.778: NFET_LA1.1 17.71,63.32 >GS_PRO.2 17.71,58.46 R12.2
N$22
  Bottom 1.778: NFET_HA.1 6.14,63.28 GS_PRO.2 6.14,59.88 R13.2
N$23  (via drill 0.6)  (1 unrouted)
  Top 1.778: v23.88,47.02 v23.89,58.47
  Bottom 0.254: GS_PRO.1 NFET_HA.3 12.77,67.31 21.81,67.31 NFET_LA1.2
  Bottom 1.676: A1.P$11 21.31,47.27
  Bottom 1.778: C_BOOTA.2 21.29,47.29 21.59,46.99 23.85,46.99 v23.88,47.02 | v23.89,58.47 21.91,61.11 NFET_LA1.2
  pour Bottom (isolate 0.61, no thermals): 11.94,69.21 23.28,69.26 23.43,60.13 12,59.8
N$24  (via drill 0.6)
  Top 1.676: v83.94,47.43 84.05,47.53
  Top 1.778: 84.05,47.53 v84.05,58.27
  Bottom 0.254: NFET_LB2.2 92.45,67.86 85.09,67.86 NFET_HB2.3 R3.1 v84.05,58.27
  Bottom 1.676: A3.P$4 83.94,44.68
  Bottom 1.778: A3.P$4 C_BOOTB2.1
  Bottom 1.93: 83.94,44.68 v83.94,47.43
  pour Bottom (isolate 0.61, no thermals): 94.48,69.31 94.48,62.61 87.52,62.61 87.52,56.38 82.35,56.38 82.35,69.3 82.37,69.3
N$25  (1 unrouted)
  Bottom 1.778: 16.47,42.1 11.68,42.1 | 16.47,42.1 21.84,42.1 arc90 23.82,44.09 | R13.1 8.55,42.44 8.88,42.11 16.46,42.11 16.47,42.1
N$26
  Bottom 1.676: R11.1 41.63,47.16 A1.P$3
N$27
  Bottom 1.676: R12.1 18.77,47.38 A1.P$12
N$28
  Bottom 1.016: JP2.2 21.19,6.47 | 29.65,15.15 R30.2 28.93,15.15
  Bottom 1.422: 21.19,6.47 C12.1 | JP2.2 21.17,3.97 arc91 21.87,3.26 30.21,3.26 arc88 30.92,3.94 30.91,11.26 30.91,13.89 arc90 29.65,15.15 | 28.93,15.15 28.93,13.62 arc-90 27.94,12.63 arc90 26.55,11.24 R29.1
N$29
  Bottom 1.676: VR2.P$1 87.96,33.24 A3.P$28 R14.1
N$30
  Bottom 1.422: R22.1 90.93,24.15 arc-89 90.16,23.4 88.2,23.4 arc90 86.24,21.43 SIG_FALSE2.2 86.24,17.79 arc90 87.53,16.49 TR4.B
N$31
  Bottom 1.016: R19.2 84.93,8.75
  Bottom 1.422: 84.93,8.75 LED_FF12.A
N$32
  Bottom 1.422: TR2.C 84.98,13.93 arc-105 LED_FF12.K
N$33
  Bottom 1.422: R20.2 84.96,5.66 LED_FF22.A
N$34
  Bottom 1.422: LED_FF22.K 89.35,12.63 arc-90 90.67,13.94 TR4.C
N$35
  Bottom 1.016: OK4.1 21.17,15.1
  Bottom 1.422: R29.2 26.55,15.74 arc90 25.3,16.99 21.81,16.99 arc90 21.17,16.36 21.17,15.1
N$36
  Bottom 1.016: R21.2 83.89,25.96
  Bottom 1.422: 83.89,25.96 83.91,25.96 A3.P$25
N$37
  Bottom 1.422: R22.2 86.44,25.78 86.45,25.78 A3.P$26
N$38
  Bottom 1.422: LED9.A R43.1
N$39
  Bottom 1.016: 23.73,15.1 OK4.2 | 23.75,12.59 C12.2 | JP2.1 23.75,6.43
  Bottom 1.422: C12.2 23.73,15.1 | JP2.1 23.75,12.59 | 23.75,6.43 arc91 24.77,5.41 LED_5V1.K
N$40
  Bottom 1.676: A1.P$27 44.15,28.02 44.74,27.43 47.45,27.43 48.37,26.38 48.37,22.36 48.84,21.88 VR_DEADTIME1.2
N$41
  Bottom 1.422: A1.P$19 21.47,27.29 R27.1 19,27.29 16.25,24.53 OK1.6
N$42
  Bottom 1.422: A1.P$16 C29.1
N$43
  Bottom 1.27: R32.1 33.78,47.33 A1.P$5
N$44
  Bottom 1.778: A1.P$6 34.02,44.55 C_BOOTB1.2
N$45  (1 unrouted)
  Bottom 1.778: 26.37,44.81 C_BOOTA.1
N$46
  Bottom 0.254: C_VREG1.1 28.1,40.96 28.93,41.79 A1.P$8 A1.P$7
  pour Bottom (no thermals): 28.25,45.23 28.25,43.73 27.2,42.68 25.89,42.68 25.89,40.24 28.95,40.24 32.1,43.39 32.07,45.44 28.23,45.43
N$47
  Bottom 1.016: R41.1 11.17,8.2
  Bottom 1.422: 11.17,8.2 LED_PWM1.A
N$48
  Bottom 1.016: 67.13,5.06 JP1.2 | 73.96,12.19 73.58,12.19
  Bottom 1.422: JP1.2 C20.1 | 67.13,5.06 arc90 69.27,2.92 76.05,2.92 arc90 76.91,3.78 76.91,14.21 arc90 76.38,14.73 R43.2 75,13.24 arc-90 73.96,12.19 | 73.58,12.19 arc90 72.72,11.33 R33.1
N$49
  Bottom 1.016: 72.72,15.5 R33.2 | OK3.1 67.13,15.05
  Bottom 1.422: 72.72,15.5 arc90 71.45,16.77 68.84,16.77 arc90 67.13,15.05
N$50
  Bottom 1.422: A1.P$15 C29.2
N$51
  Bottom 1.676: VR1.P$2 37.57,35.51 R28.2 34.15,35.5 31.02,35.5 28.8,33.28 C24.1 26.4,29.65 A1.P$20
N$52
  Bottom 1.016: 26.11,22.72 26.26,22.88
  Bottom 1.422: OK4.3 26.11,22.72 27.43,22.72 R31.1 | 26.26,22.88 R42.1
N$53
  Bottom 1.422: A1.P$23 A1.P$22 28.93,29.62 A1.P$21
  Bottom 1.676: R28.1 34.16,29.79 A1.P$23
N$54
  Bottom 1.016: 11.17,12.75 LED_PWM1.K | JP2.4 16.25,6.6 | 16.25,12.7 16.36,12.59
  Bottom 1.422: JP2.4 10.7,6.47 arc-90 8.81,8.04 8.81,11.86 arc-90 10.16,12.75 11.17,12.75 | 16.25,6.6 16.25,12.7 OK1.3 | 16.36,12.59 SBD1.A
N$55
  Bottom 1.016: 13.68,15.07 OK1.2 | SBD1.C
  Bottom 1.422: R36.2 SBD1.C 13.68,15.07
N$56
  Bottom 1.422: R41.2 R36.1 17.54,3.26 arc90 18.67,4.35 JP2.3
N$57  (via drill 0.4 pad 3)
  other vias: 3.16,80.17
N$58  (1 unrouted)
  Bottom 1.016: 36.53,28.82 36.53,29.56
  Bottom 1.422: R42.2 31.34,26.6 arc-90 32.52,27.55 35.48,27.55 arc90 36.53,28.82
N$59
  Bottom 1.422: R35.1
  Bottom 1.676: R35.1 A1.P$28 46.7,29.64 46.7,31.48 45.17,33.02 VR1.P$1
N$60
  Bottom 1.422: TR3.B 43.1,16.43 arc-90 41.73,17.79 SIG_FALSE1.2 41.73,21.08 arc-90 R40.1
N$61
  Bottom 1.016: R37.2
  Bottom 1.422: R37.2 LED_FF11.A
N$62
  Bottom 1.422: TR1.C 41.9,14.1 arc-90 42.74,13.27 LED_FF11.K
N$63
  Bottom 1.016: 47.51,6.29 LED_FF21.A
  Bottom 1.422: R38.2 47.51,6.29
N$64
  Bottom 1.016: 47.51,8.81 LED_FF21.K
  Bottom 1.422: TR3.C 46.49,13.89 arc90 45.2,12.59 45.2,9.56 arc90 45.95,8.81 47.51,8.81
N$65
  Bottom 1.422: A1.P$25 arc90 38.93,29.51 R39.2
N$66
  Bottom 1.422: A1.P$26 arc90 41.32,29.33 R40.2
N$67
  Bottom 1.422: LED9.K 70.81,4.95 arc-90 JP1.1 C20.2 OK3.2
N$68
  Bottom 1.016: 56.96,8.01 R_LED_SA.1
  Bottom 1.422: LED_SA.A 56.96,8.01
N$69
  Bottom 1.016: 64.59,12.07 SBD2.A | 56.65,12.4 LED_SA.K | 61.95,6.09 JP1.4
  Bottom 1.422: JP1.4 62.05,12.07 | 62.05,12.07 OK2.3 | 62.05,12.07 64.59,12.07 | 56.65,12.4 arc90 55.06,10.78 55.06,7.31 arc91 56.28,6.07 61.95,6.09
N$70
  Bottom 1.422: OK2.2 SBD2.C R_PC_SA.2
N$71  (via drill 0.4 pad 3)
  other vias: 13.94,80.17
N$72
  Bottom 1.422: R_LED_SA.2 R_PC_SA.1 63.17,2.92 arc90 64.59,4.34 JP1.3
N$73  (1 unrouted)
  Bottom 1.016: 81.27,29.33 81.32,29.46
  Bottom 1.422: R46.2 76.44,24.67 76.44,26.59 arc-90 77.53,27.56 79.6,27.55 arc89 81.27,29.33
N$74
  Bottom 1.27: A3.P$27 88.99,28.66 90.11,27.55 91.76,27.55 92.88,26.43 92.87,21.75 VR_DEADTIME2.2
N$75
  Bottom 1.676: A3.P$16 61.03,29.73 C8.1
N$76
  Bottom 1.676: C8.2 58.48,26.93 A3.P$15
N$77
  Bottom 1.778: NFET_HB2.1 76.41,63.12 R3.2 76.41,58.75 R23.2
N$78
  Bottom 1.778: R26.2 53.58,57.97 R4.2 53.58,63.41 NFET_HA2.1
N$79  (via drill 0.4 pad 3)
  other vias: 96.39,3.23
N$80  (via drill 0.4 pad 3)
  other vias: 96.08,80.05
N$81  (via drill 0.4 pad 3)
  other vias: 40.28,80.14
N$82  (via drill 0.4 pad 3)
  other vias: 3.4,3.28
N$83  (via drill 0.4 pad 1.6)
  other vias: 54.43,22.35
N$84  (via drill 0.4 pad 1.6)
  other vias: 8.61,22.65
N$85  (via drill 0.4 pad 1.6)
  other vias: 8.54,15.08
N$86  (via drill 0.4 pad 3)
  other vias: 60.44,80.2
N$87
  Bottom 1.778: C4.2 61.06,49.52 BAT_PRO.C 61.04,47.15 A3.P$13 A3.P$14
N$94  (via drill 0.6)
  Top 1.778: v2.65,44.54 A1.P$14
  Bottom 1.778: C5.2 16.25,46.88 BAT_PRO1.C 16.25,44.56 A1.P$13 A1.P$14 | R_LED.1 2.69,31.01 5VREG.P$1 2.67,34.37 C_5VREG_IN.1 2.69,38.35 EC_5VREG_IN.P$1 2.69,42.6 v2.65,44.54

### Text on the board
tNames: NFET_HA | NFET_LA | NFET_HB | NFET_LB | NFET_HA | NFET_LA | NFET_HB | NFET_LB | GS_PRO | GS_PRO | GS_PRO | GS_PRO | GS_PRO | GS_PRO | GS_PRO | GS_PRO | B_PRO | B_PRO | B_PRO | B_PRO | B_PRO | B_PRO | B_PRO | B_PRO | C_BOOTA | C_BOOTA | C_BOOTB | C_BOOTB | NH_CON_3 | NH_CON_3 | FF1 | FF2 | GND | FF1 | FF2 | GND | 2013 TUT | A3941_MD | FusionPCB | PWM | PWM | VR_DEADTIME | 25k is 1us. | FF1 | VR_DEADTIME | 25k is 1us. | NH_CON_4 | NH_CON_4 | FF1 | 5V | FF2 | 5V | FF2 | +/-/5/G | +/-/5/G